# Altium schematic sheet 5_4_transceiver.SchDoc: LoRa node transceiver
size A4; OrganizationName: Pluton UPV; Address1: Universitat Politècnica; Address2: de València (UPV); Address3: Camí de Vera, València; Address4: Spain; SheetNumber: 10; SheetTotal: 12
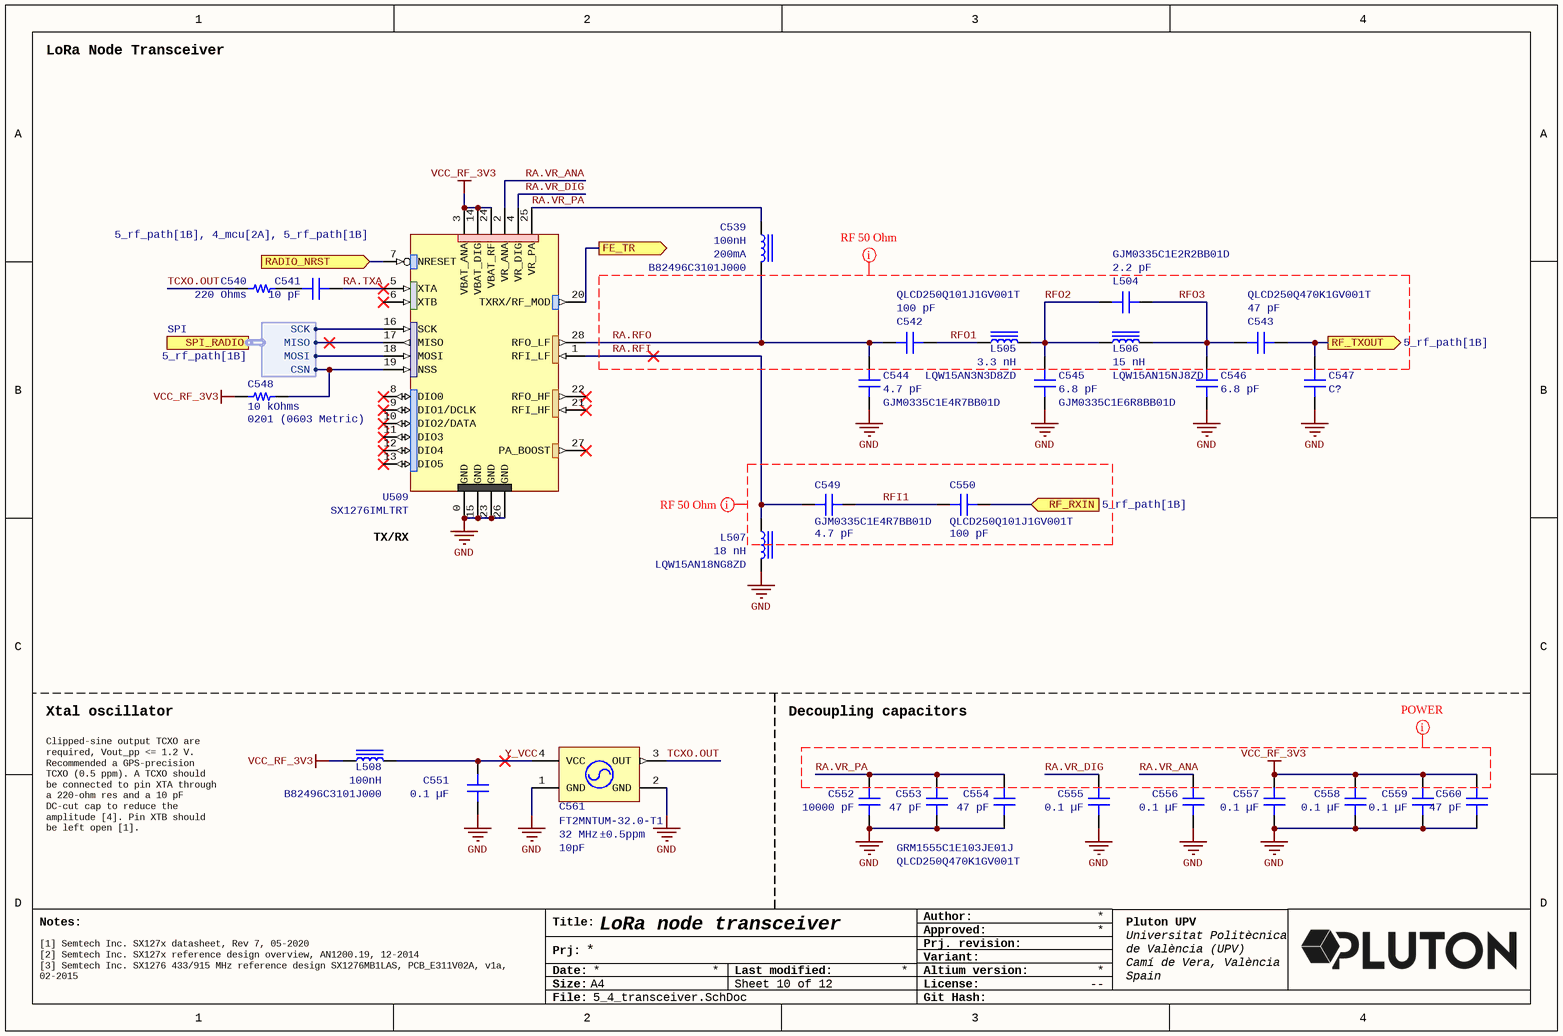
[diagram p0: 5_4_transceiver.SchDoc]

## Parts
C539  100nH  Part Number: B82496C3101J000  Current Rating (Amps): 200mA  [IND 0603_1608 RF WW]
C540  220 Ohms  [RES 0201_0603]
C541  10 pF  [CAP 0201_0603]
C542  Part Number: QLCD250Q101J1GV001T  [CAP 0201_0603 RF]  (hidden comment: 100 pF)
C543  Part Number: QLCD250Q470K1GV001T  [CAP 0201_0603 RF]  (hidden comment: 47 pF)
C544  Part Number: GJM0335C1E4R7BB01D  [CAP 0201_0603 RF]  (hidden comment: 4.7 pF)
C545  Part Number: GJM0335C1E6R8BB01D  [CAP 0201_0603 RF]  (hidden comment: 6.8 pF)
C546  6.8 pF  [CAP 0201_0603 RF]
C547  C?  [CAP 0201_0603]
C548  Package / Case: 0201 (0603 Metric)  [RES 0201_0603]  (hidden comment: 10 kOhms)
C549  Part Number: GJM0335C1E4R7BB01D  [CAP 0201_0603 RF]  (hidden comment: 4.7 pF)
C550  Part Number: QLCD250Q101J1GV001T  [CAP 0201_0603 RF]  (hidden comment: 100 pF)
C551  0.1 µF  [CAP 0402_1005]
C552  Part Number: GRM1555C1E103JE01J  [CAP 0402_1005]  (hidden comment: 10000 pF)
C553  47 pF  [CAP 0201_0603 RF]
C554  Part Number: QLCD250Q470K1GV001T  [CAP 0201_0603 RF]  (hidden comment: 47 pF)
C555  0.1 µF  [CAP 0402_1005]
C556  0.1 µF  [CAP 0402_1005]
C557  0.1 µF  [CAP 0402_1005]
C558  0.1 µF  [CAP 0402_1005]
C559  0.1 µF  [CAP 0402_1005]
C560  47 pF  [CAP 0201_0603 RF]
C561  Frequency: 32 MHz  Tolerance: ±0.5ppm  Load Capacitance: 10pF  [TCXO-XTAL-FT2MN]  (hidden comment: FT2MNTUM-32.0-T1)
L504  Part Number: GJM0335C1E2R2BB01D  [CAP 0201_0603]  (hidden comment: 2.2 pF)
L505  Part Number: LQW15AN3N3D8ZD  [IND 0402_1005 RF WW]  (hidden comment: 3.3 nH)
L506  Part Number: LQW15AN15NJ8ZD  [IND 0402_1005 RF WW]  (hidden comment: 15 nH)
L507  Part Number: LQW15AN18NG8ZD  [IND 0402_1005 RF WW]  (hidden comment: 18 nH)
L508  100nH  Part Number: B82496C3101J000  [IND 0603_1608 RF WW]
U509  SX1276IMLTRT  [QFN-28]

## Ports
FE_TR (out, see 5_rf_path[1B], 5_3_frontend[3A]), RADIO_NRST (in, see 5_rf_path[1B], 4_mcu[2A], 5_rf_path[1B]), RF_RXIN (in, see 5_rf_path[1B]), RF_TXOUT (out, see 5_rf_path[1B]), SPI_RADIO (harness SPI, see 5_rf_path[1B])

## Harnesses
SPI: CSN, MOSI, SCK, MISO

## Nets
GND: C544.1 C545.1 C546.1 C547.1 C551.1 C552.1 C553.1 C554.2 C555.1 C556.1 C557.1 C558.1 C559.1 C560.1 C561.1(GND) C561.2(GND) L507.2 U509.0(GND) U509.15(GND) U509.23(GND) U509.26(GND)
VCC_RF_3V3: C548.1 C557.2 C558.2 C559.2 C560.2 L508.1 U509.3(VBAT_ANA) U509.14(VBAT_DIG) U509.24(VBAT_RF)
FE_TR: U509.20(TXRX/RF_MOD) ; port FE_TR
RA.RFI: C549.2 L507.1 U509.1(RFI_LF)
RA.RFO: C539.2 C542.1 C544.2 U509.28(RFO_LF)
RA.TXA: C541.1 U509.5(XTA)
RA.VR_ANA: C556.2 U509.2(VR_ANA)
RA.VR_DIG: C555.2 U509.4(VR_DIG)
RA.VR_PA: C539.1 C552.2 C553.2 C554.1 U509.25(VR_PA)
RADIO_NRST: U509.7(NRESET) ; port RADIO_NRST
RF_RXIN: C550.1 ; port RF_RXIN
RF_TXOUT: C543.2 C547.2 ; port RF_TXOUT
RFI1: C549.1 C550.2
RFO1: C542.2 L505.1
RFO2: C545.2 L504.1 L505.2 L506.1
RFO3: C543.1 C546.2 L504.2 L506.2
TCXO.OUT: C540.1 C561.3(OUT)
Y_VCC: C551.2 C561.4(VCC) L508.2
NetC540_2: C540.2 C541.2
NetC548_2: C548.2 U509.19(NSS) ; port SPI_RADIO.CSN
NetU509_16: U509.16(SCK) ; port SPI_RADIO.SCK
NetU509_17: U509.17(MISO) ; port SPI_RADIO.MISO
NetU509_18: U509.18(MOSI) ; port SPI_RADIO.MOSI

Not connected (* = marked no-connect by the designer): U509 6(XTB)* 8(DIO0)* 9(DIO1/DCLK)* 10(DIO2/DATA)* 11(DIO3)* 12(DIO4)* 13(DIO5)* 21(RFI_HF)* 22(RFO_HF)* 27(PA_BOOST)*

## Layout directives
rule Width Constraint [Pref Width = 0.4mm    Min Width = 0.3mm    Max Width = 0.5mm]; net class POWER: RA.VR_ANA, RA.VR_DIG, RA.VR_PA, VCC_RF_3V3
net class RF50; rule Width Constraint [Pref Impedance = 50.00ohms    Min Impedance = 50.00ohms    Max Impedance = 50.00ohms]: RA.RFI, RA.RFO, RFI1, RFO1, RFO2, RFO3

## Notes on the sheet
- LoRa Node Transceiver
- (near U509) TX/RX
- Xtal oscillator
- Decoupling capacitors
- Clipped-sine output TCXO are required, Vout_pp <= 1.2 V. Recommended a GPS-precision TCXO (0.5 ppm). A TCXO should be connected to pin XTA through a 220-ohm res and a 10 pF DC-cut cap to reduce the amplitude [4]. Pin XTB should be left open [1].
- [1] Semtech Inc. SX127x datasheet, Rev 7, 05-2020
  [2] Semtech Inc. SX127x reference design overview, AN1200.19, 12-2014
  [3] Semtech Inc. SX1276 433/915 MHz reference design SX1276MB1LAS, PCB_E311V02A, v1a, 02-2015
- Notes:
- Title:
- Author:
- Approved:
- Date:
- Prj:
- Size:
- A4
- Last modified:
- Altium version:
- Variant:
- Prj. revision:
- License:
- --
- File:
- Git Hash:

## Library data of the parts
C539 L508 = B82496C3101J000: FIXED IND 100NH 200MA 1.8 OHM; Manufacturer: TDK Electronics Inc.; DC Resistance (DCR): 1.8Ohm Max; Frequency - Self Resonant: 1.8GHz; Inductance Frequency - Test: 100MHz; Material - Core: Ceramic; Q @ Freq: 14 @ 100MHz; Shielding: Unshielded; Tolerance: ±5%; Type: Wirewound; ComponentLink1Description: Datasheet; ComponentLink1URL: https://www.tdk-electronics.tdk.com/inf/30/db/ind_2008/b82496c.pdf; ComponentLink2Description: DigiKey Link; ComponentLink2URL: http://digikey.com/product-detail/en/tdk-electronics-inc/B82496C3101J000/495-1825-1-ND/697680; Device Package: 0603 (1608 Metric); Inductance: 100nH; LastUpdated: 06/09/2020 11:05:16; Lifecycle Status: Active; Minimum Order: 1; Mounting Type: Surface Mount; Operating Temperature: -55°C ~ 150°C; Package / Case: 0603 (1608 Metric); Packaging: TapeAndReel; PartId: 755; Part Status: Active; Price: 0.16; Ratings: AEC-Q200; Series: SIMID; Supplier 1: DigiKey; Supplier Part Number 1: 495-1825-1-ND; Supplier Device Package: 0603 (1608 Metric); Value: 100nH
  L508: Current Rating (Amps): 200mA
C540 = RC0201FR-07220RL: RES 220 OHM 1% 1/20W 0201; Manufacturer: Yageo; Power (Watts): 0.05W, 1/20W; Temperature Coefficient: ±200ppm/°C; Part Number: RC0201FR-07220RL; Value: 220 Ohms; ComponentLink1Description: Datasheet; ComponentLink1URL: https://www.yageo.com/upload/media/product/productsearch/datasheet/rchip/PYu-RC_Group_51_RoHS_L_10.pdf; ComponentLink2Description: DigiKey Link; ComponentLink2URL: https://www.digikey.com/en/products/detail/yageo/RC0201FR-07220RL/5280369; Composition: Thick Film; Device Package: 0201 (0603 Metric); Features: Moisture Resistant; Height - Seated (Max): 0.010" (0.26mm); LastUpdated: 04/06/2024 19:12:00; Lifecycle Status: Active; Minimum Order: 1; Number of Terminations: 2; Operating Temperature: -55°C ~ 125°C; Package / Case: 0201 (0603 Metric); Packaging: TapeAndReel; PartId: 816; Part Status: Active; Price: 0.01; Resistance: 220 Ohms; Series: RC_L; Size / Dimension: 0.024" L x 0.012" W (0.60mm x 0.30mm); Supplier 1: DigiKey; Supplier Part Number 1: YAG2509CT-ND; Supplier Device Package: 0201; Tolerance: ±1%
C541 = GJM0335C1E100GB01D: CAP CER 10PF 25V C0G/NP0 0201; manufacturer: Murata Electronics; Temperature Coefficient: C0G, NP0; Tolerance: ±2%; Part Number: GJM0335C1E100GB01D; Value: 10 pF; Applications: RF, Microwave, High Frequency; Capacitance: 10 pF; componentlink1description: Datasheet; componentlink1url: https://search.murata.co.jp/Ceramy/image/img/A01X/G101/ENG/GJM0335C1E100GB01-01.pdf; componentlink2description: DigiKey Link; componentlink2url: https://www.digikey.com/en/products/detail/murata-electronics/GJM0335C1E100GB01D/7363126; Device Package: 0201 (0603 Metric); Features: High Q, Low Loss; lastupdated: 04/06/2024 19:01:11; Lifecycle Status: Active; Minimum Order: 1; Mounting Type: Surface Mount, MLCC; Operating Temperature: -55°C ~ 125°C; Package / Case: 0201 (0603 Metric); packaging: TapeAndReel; partid: 213; Part Status: Active; price: 0.01; series: GJM; Size / Dimension: 0.024" L x 0.012" W (0.60mm x 0.30mm); Supplier 1: DigiKey; Supplier Part Number 1: 490-16382-1-ND; Thickness (Max): 0.013" (0.33mm); Voltage - Rated: 25V
C542 C550 = QLCD250Q101J1GV001T: CAP CER 100PF 25V C0G/NP0 0201; manufacturer: Johanson Technology Inc.; Temperature Coefficient: C0G, NP0; Tolerance: ±5%; Applications: RF, Microwave, High Frequency; Capacitance: 100 pF; componentlink1description: Datasheet; componentlink1url: https://www.johansontechnology.com/downloads/catalog/johanson-technology-multi-layer-high-q-capacitors.pdf; componentlink2description: DigiKey Link; componentlink2url: https://www.digikey.com/en/products/detail/johanson-technology-inc/QLCD250Q101J1GV001T/1561511; Device Package: 0201 (0603 Metric); Features: High Q, Low Loss; lastupdated: 03/06/2024 19:34:07; Lifecycle Status: Active; Minimum Order: 1; Mounting Type: Surface Mount, MLCC; Operating Temperature: -55°C ~ 125°C; Package / Case: 0201 (0603 Metric); packaging: TapeAndReel; partid: 3724; Part Status: Active; price: 0.02; series: L; Size / Dimension: 0.024" L x 0.012" W (0.60mm x 0.30mm); Supplier 1: DigiKey; Supplier Part Number 1: 712-QLCD250Q101J1GV001TCT-ND; Thickness (Max): 0.013" (0.33mm); value: 100 pF; Voltage - Rated: 25V
C543 C553 C554 C560 = QLCD250Q470K1GV001T: CAP CER 47PF 25V NP0 0201; manufacturer: Johanson Technology Inc.; Temperature Coefficient: C0G, NP0; Tolerance: ±10%; Applications: RF, Microwave, High Frequency; Capacitance: 47 pF; componentlink1description: Datasheet; componentlink1url: https://www.johansontechnology.com/downloads/catalog/johanson-technology-multi-layer-high-q-capacitors.pdf; componentlink2description: DigiKey Link; componentlink2url: https://www.digikey.com/en/products/detail/johanson-technology-inc/QLCD250Q470K1GV001T/1919286; Device Package: 0201 (0603 Metric); Features: High Q, Low Loss; lastupdated: 03/06/2024 19:34:07; Lifecycle Status: Active; Minimum Order: 1; Mounting Type: Surface Mount, MLCC; Operating Temperature: -55°C ~ 125°C; Package / Case: 0201 (0603 Metric); packaging: TapeAndReel; partid: 3708; Part Status: Active; price: 0.01; series: L; Size / Dimension: 0.024" L x 0.012" W (0.60mm x 0.30mm); Supplier 1: DigiKey; Supplier Part Number 1: 712-QLCD250Q470K1GV001TCT-ND; Thickness (Max): 0.013" (0.33mm); value: 47 pF; Voltage - Rated: 25V
  C553 C560: Part Number: QLCD250Q470K1GV001T
C544 C549 = GJM0335C1E4R7BB01D: CAP CER 4.7PF 25V C0G/NP0 0201; manufacturer: Murata Electronics; Temperature Coefficient: C0G, NP0; Tolerance: ±0.1pF; Applications: RF, Microwave, High Frequency; Capacitance: 4.7 pF; componentlink1description: Datasheet; componentlink1url: https://search.murata.co.jp/Ceramy/image/img/A01X/G101/ENG/GJM0335C1E4R7BB01-01.pdf; componentlink2description: DigiKey Link; componentlink2url: https://www.digikey.com/en/products/detail/murata-electronics/GJM0335C1E4R7BB01D/2592646; Device Package: 0201 (0603 Metric); Features: High Q, Low Loss; lastupdated: 03/06/2024 19:34:09; Lifecycle Status: Active; Minimum Order: 1; Mounting Type: Surface Mount; Operating Temperature: -55°C ~ 125°C; Package / Case: 0201 (0603 Metric); packaging: TapeAndReel; partid: 265; Part Status: Active; price: 0.01; series: GJM; Size / Dimension: 0.024" L x 0.012" W (0.60mm x 0.30mm); Supplier 1: DigiKey; Supplier Part Number 1: 490-8072-1-ND; Thickness (Max): 0.013" (0.33mm); value: 4.7 pF; Voltage - Rated: 25V
C545 C546 = GJM0335C1E6R8BB01D: CAP CER 6.8PF 25V C0G/NP0 0201; manufacturer: Murata Electronics; Temperature Coefficient: C0G, NP0; Tolerance: ±0.1pF; Applications: RF, Microwave, High Frequency; Capacitance: 6.8 pF; componentlink1description: Datasheet; componentlink1url: https://search.murata.co.jp/Ceramy/image/img/A01X/G101/ENG/GJM0335C1E6R8BB01-01.pdf; componentlink2description: DigiKey Link; componentlink2url: https://www.digikey.com/en/products/detail/murata-electronics/GJM0335C1E6R8BB01D/2592738; Device Package: 0201 (0603 Metric); Features: High Q, Low Loss; lastupdated: 03/06/2024 19:34:10; Lifecycle Status: Active; Minimum Order: 1; Mounting Type: Surface Mount; Operating Temperature: -55°C ~ 125°C; Package / Case: 0201 (0603 Metric); packaging: TapeAndReel; partid: 115; Part Status: Active; price: 0.01; series: GJM; Size / Dimension: 0.024" L x 0.012" W (0.60mm x 0.30mm); Supplier 1: DigiKey; Supplier Part Number 1: 490-11183-1-ND; Thickness (Max): 0.013" (0.33mm); value: 6.8 pF; Voltage - Rated: 25V
  C546: Part Number: GJM0335C1E6R8BB01D
C547 L504 = GJM0335C1E2R2BB01D: CAP CER 2.2PF 25V C0G/NP0 0201; manufacturer: Murata Electronics; Temperature Coefficient: C0G, NP0; Tolerance: ±0.1pF; Applications: RF, Microwave, High Frequency; Capacitance: 2.2 pF; componentlink1description: Datasheet; componentlink1url: https://search.murata.co.jp/Ceramy/image/img/A01X/G101/ENG/GJM0335C1E2R2BB01-01.pdf; componentlink2description: DigiKey Link; componentlink2url: https://www.digikey.com/en/products/detail/murata-electronics/GJM0335C1E2R2BB01D/2592553; Device Package: 0201 (0603 Metric); Features: High Q, Low Loss; lastupdated: 04/06/2024 19:01:06; Lifecycle Status: Active; Minimum Order: 1; Mounting Type: Surface Mount; Operating Temperature: -55°C ~ 125°C; Package / Case: 0201 (0603 Metric); packaging: TapeAndReel; partid: 1246; Part Status: Active; price: 0.01; series: GJM; Size / Dimension: 0.024" L x 0.012" W (0.60mm x 0.30mm); Supplier 1: DigiKey; Supplier Part Number 1: 490-8070-1-ND; Thickness (Max): 0.013" (0.33mm); Voltage - Rated: 25V
  C547: Part Number: GJM0335C1E2R2BB01D; Value: C?
  L504: Value: 2.2 pF
C548 = AF0201FR-0710KL: RES SMD 10K OHM 1% 1/20W 0201; Manufacturer: Yageo; Power (Watts): 0.05W, 1/20W; Temperature Coefficient: ±200ppm/°C; Part Number: AF0201FR-0710KL; Value: 10 kOhms; ComponentLink1Description: Datasheet; ComponentLink1URL: https://www.yageo.com/upload/media/product/productsearch/datasheet/rchip/PYu-AF_51_RoHS_L_9.pdf; ComponentLink2Description: DigiKey Link; ComponentLink2URL: https://www.digikey.com/en/products/detail/yageo/AF0201FR-0710KL/5900138; Composition: Thick Film; Device Package: 0201 (0603 Metric); Features: Anti-Sulfur, Automotive AEC-Q200; Height - Seated (Max): 0.010" (0.26mm); LastUpdated: 04/06/2024 19:11:47; Lifecycle Status: Active; Minimum Order: 1; Number of Terminations: 2; Operating Temperature: -55°C ~ 125°C; Packaging: TapeAndReel; PartId: 78061; Part Status: Active; Price: 0.01; Ratings: AEC-Q200; Resistance: 10 kOhms; Series: AF; Size / Dimension: 0.024" L x 0.012" W (0.60mm x 0.30mm); Supplier 1: DigiKey; Supplier Part Number 1: 13-AF0201FR-0710KLCT-ND; Supplier Device Package: 0201; Tolerance: ±1%
C551 C555-C559 = C0402C104K4RECAUTO: CAP CER 0402 0.1UF 16V X7R 10%; manufacturer: KEMET; Part Number: C0402C104K4RECAUTO; Value: 0.1 µF; Applications: Automotive, ESD Protection; Capacitance: 0.1 µF; componentlink1description: Datasheet; componentlink1url: https://api.kemet.com/component-edge/download/datasheet/C0402C104K4RECAUTO.pdf; componentlink2description: DigiKey Link; componentlink2url: https://www.digikey.com/en/products/detail/kemet/C0402C104K4RECAUTO/8563695; Device Package: 0402 (1005 Metric); lastupdated: 09/02/2024 20:04:38; Lifecycle Status: Active; Minimum Order: 1; Mounting Type: Surface Mount, MLCC; Operating Temperature: -55°C ~ 125°C; Package / Case: 0402 (1005 Metric); packaging: TapeAndReel; partid: 1731; Part Status: Active; price: 0.01; Ratings: AEC-Q200; series: ESD SMD Auto X7R; Size / Dimension: 0.039" L x 0.020" W (1.00mm x 0.50mm); Supplier 1: DigiKey; Supplier Part Number 1: 399-17167-1-ND; Temperature Coefficient: X7R; Thickness (Max): 0.022" (0.55mm); Tolerance: ±10%; Voltage - Rated: 16V
C552 = GRM1555C1E103JE01J: CAP CER 10000PF 25V C0G/NP0 0402; manufacturer: Murata Electronics; Temperature Coefficient: C0G, NP0; Tolerance: ±5%; Value: 10000 pF; Applications: General Purpose; Capacitance: 10000 pF; componentlink1description: Datasheet; componentlink1url: https://search.murata.co.jp/Ceramy/image/img/A01X/G101/ENG/GRM1555C1E103JE01-01A.pdf; componentlink2description: DigiKey Link; componentlink2url: https://www.digikey.com/en/products/detail/murata-electronics/GRM1555C1E103JE01J/16033801; Device Package: 0402 (1005 Metric); lastupdated: 09/02/2024 20:04:09; Lifecycle Status: Active; Minimum Order: 1; Mounting Type: Surface Mount, MLCC; Operating Temperature: -55°C ~ 125°C; Package / Case: 0402 (1005 Metric); packaging: TapeAndReel; partid: 41084; Part Status: Active; price: 0.02; series: GRM; Size / Dimension: 0.039" L x 0.020" W (1.00mm x 0.50mm); Supplier 1: DigiKey; Supplier Part Number 1: 490-GRM1555C1E103JE01JCT-ND; Thickness (Max): 0.026" (0.65mm); Voltage - Rated: 25V
L505 = LQW15AN3N3D8ZD: FIXED IND 3.3NH 2A 0.03OHM SMD; Manufacturer: Murata Electronics; DC Resistance (DCR): 30mOhm Max; Frequency - Self Resonant: 14GHz; Inductance Frequency - Test: 100 MHz; Material - Core: Non-Magnetic; Q @ Freq: 30 @ 250MHz; Shielding: Unshielded; Tolerance: ±0.5nH; Type: Drum Core, Wirewound; ComponentLink1Description: Datasheet; ComponentLink1URL: https://search.murata.co.jp/Ceramy/image/img/P02/JELF243A-9138.pdf; ComponentLink2Description: DigiKey Link; ComponentLink2URL: https://www.digikey.com/en/products/detail/murata-electronics/LQW15AN3N3D8ZD/6798846; Current Rating (Amps): 2 A; Device Package: 0402 (1005 Metric); Height - Seated (Max): 0.024" (0.60mm); Inductance: 3.3 nH; LastUpdated: 03/06/2024 20:03:24; Lifecycle Status: Active; Minimum Order: 1; Mounting Type: Surface Mount; Operating Temperature: -55°C ~ 125°C; Package / Case: 0402 (1005 Metric); Packaging: TapeAndReel; PartId: 69; Part Status: Active; Price: 0.06; Ratings: AEC-Q200; Series: LQW15; Size / Dimension: 0.039" L x 0.024" W (1.00mm x 0.60mm); Supplier 1: DigiKey; Supplier Part Number 1: 490-15421-1-ND; Value: 3.3 nH
L506 = LQW15AN15NJ8ZD: FIXED IND 15NH 1.15A 0.114OHM SM; Manufacturer: Murata Electronics; DC Resistance (DCR): 114mOhm Max; Frequency - Self Resonant: 5.5GHz; Inductance Frequency - Test: 100 MHz; Material - Core: Non-Magnetic; Q @ Freq: 31 @ 250MHz; Shielding: Unshielded; Tolerance: ±5%; Type: Drum Core, Wirewound; ComponentLink1Description: Datasheet; ComponentLink1URL: https://search.murata.co.jp/Ceramy/image/img/P02/JELF243A-9138.pdf; ComponentLink2Description: DigiKey Link; ComponentLink2URL: https://www.digikey.com/en/products/detail/murata-electronics/LQW15AN15NJ8ZD/6798767; Current Rating (Amps): 1.15 A; Device Package: 0402 (1005 Metric); Height - Seated (Max): 0.024" (0.60mm); Inductance: 15 nH; LastUpdated: 03/06/2024 20:03:24; Lifecycle Status: Active; Minimum Order: 1; Mounting Type: Surface Mount; Operating Temperature: -55°C ~ 125°C; Package / Case: 0402 (1005 Metric); Packaging: TapeAndReel; PartId: 108; Part Status: Active; Price: 0.06; Ratings: AEC-Q200; Series: LQW15; Size / Dimension: 0.039" L x 0.024" W (1.00mm x 0.60mm); Supplier 1: DigiKey; Supplier Part Number 1: 490-15342-1-ND; Supplier Device Package: 0402 (1005 Metric); Value: 15 nH
L507 = LQW15AN18NG8ZD: FIXED IND 18NH 1.05A 0.13OHM SMD; Manufacturer: Murata Electronics; DC Resistance (DCR): 130mOhm Max; Frequency - Self Resonant: 5.2GHz; Inductance Frequency - Test: 100 MHz; Material - Core: Non-Magnetic; Q @ Freq: 30 @ 250MHz; Shielding: Unshielded; Tolerance: ±2%; Type: Drum Core, Wirewound; ComponentLink1Description: Datasheet; ComponentLink1URL: https://search.murata.co.jp/Ceramy/image/img/P02/JELF243A-9138.pdf; ComponentLink2Description: DigiKey Link; ComponentLink2URL: https://www.digikey.com/en/products/detail/murata-electronics/LQW15AN18NG8ZD/6798772; Current Rating (Amps): 1.05 A; Device Package: 0402 (1005 Metric); Height - Seated (Max): 0.024" (0.60mm); Inductance: 18 nH; LastUpdated: 03/06/2024 20:03:23; Lifecycle Status: Active; Minimum Order: 1; Mounting Type: Surface Mount; Operating Temperature: -55°C ~ 125°C; Package / Case: 0402 (1005 Metric); Packaging: TapeAndReel; PartId: 193; Part Status: Active; Price: 0.07; Ratings: AEC-Q200; Series: LQW15; Size / Dimension: 0.039" L x 0.024" W (1.00mm x 0.60mm); Supplier 1: DigiKey; Supplier Part Number 1: 490-15347-1-ND; Supplier Device Package: 0402 (1005 Metric); Value: 18 nH
U509 = SX1276IMLTRT: 137 MHz to 1020 MHz Low Power Long Range Transceiver
C561 = FT2MNTUM-32.0-T1: Part Number: FT2MNTUM-32.0-T1